# Altium schematic sheet 3.ETH.SchDoc: MC-IMX6UL-CORE
size A4; DrawnBy: DrawnBy; DocumentNumber: MC-IMX6UL-CORE; Revision: V1.1; SheetNumber: 3 of 9
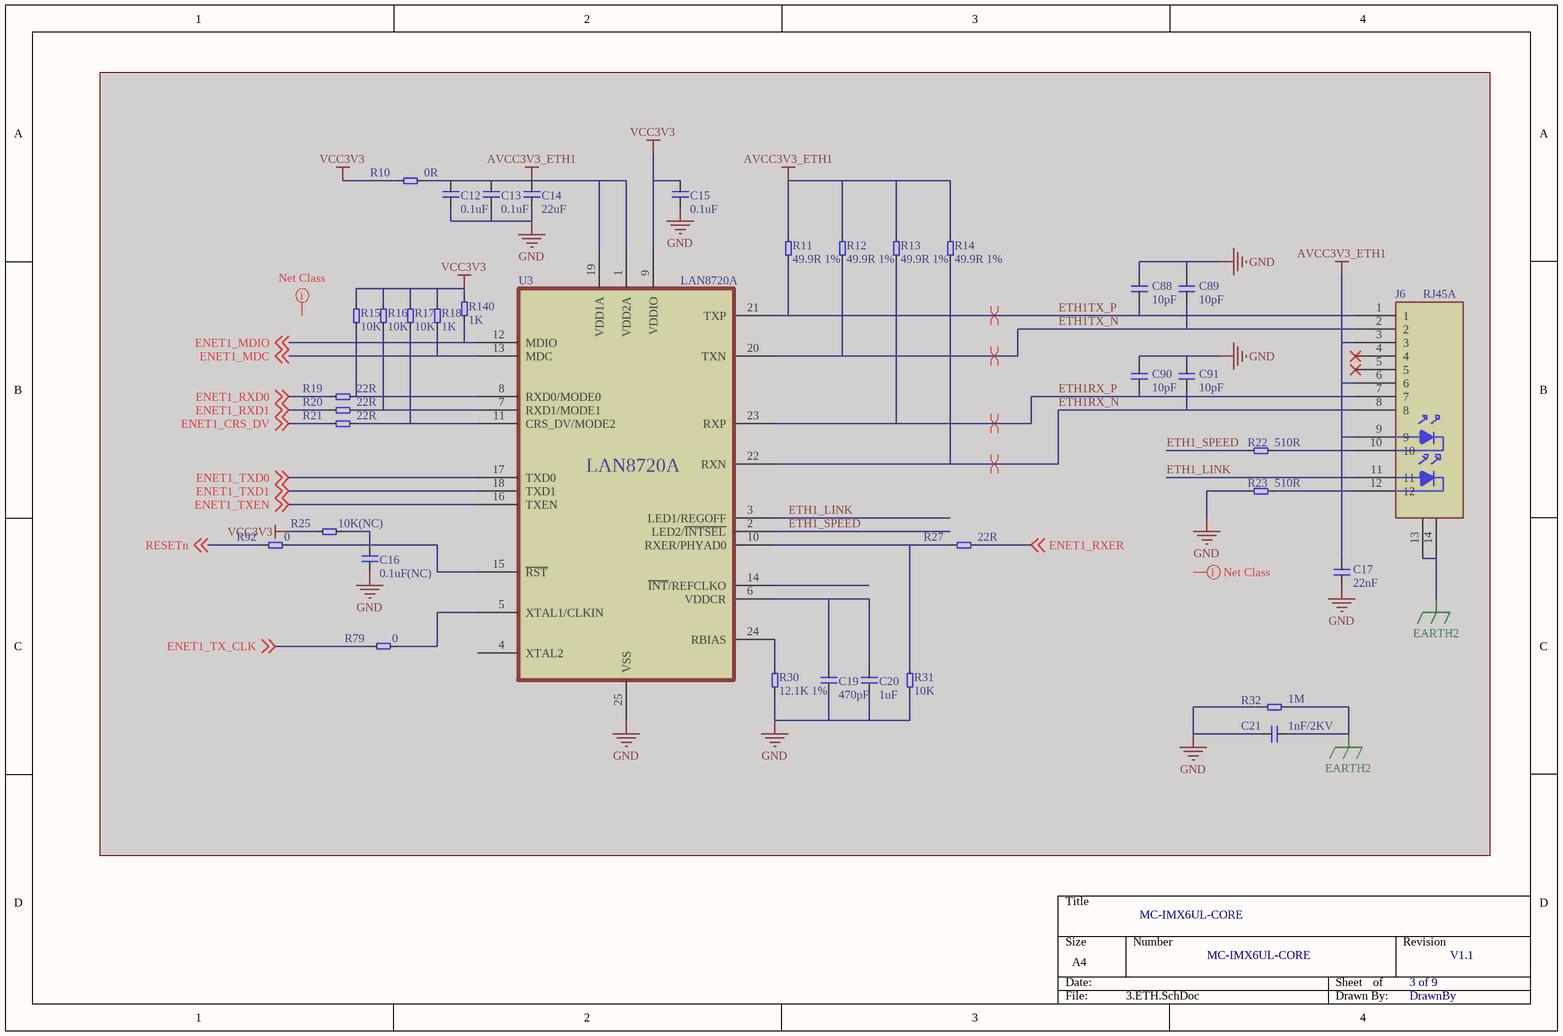
[diagram p0: 3.ETH.SchDoc]

## Parts
C12  0.1uF  [0603C]  (masked out: inside a compile mask, not in the netlist)
C13  0.1uF  [0603C]  (masked out: inside a compile mask, not in the netlist)
C14  22uF  [0805C]  (masked out: inside a compile mask, not in the netlist)
C15  0.1uF  [0603C]  (masked out: inside a compile mask, not in the netlist)
C16  0.1uF(NC)  [0603C]  (masked out: inside a compile mask, not in the netlist)
C17  22nF  [0603C]  (masked out: inside a compile mask, not in the netlist)
C19  470pF  [0603C]  (masked out: inside a compile mask, not in the netlist)
C20  1uF  [0603C]  (masked out: inside a compile mask, not in the netlist)
C21  1nF/2KV  [DC-200]  (masked out: inside a compile mask, not in the netlist)
C88  10pF  [0603C]  (masked out: inside a compile mask, not in the netlist)
C89  10pF  [0603C]  (masked out: inside a compile mask, not in the netlist)
C90  10pF  [0603C]  (masked out: inside a compile mask, not in the netlist)
C91  10pF  [0603C]  (masked out: inside a compile mask, not in the netlist)
J6  RJ45A  [RJ45B-13F-60LDNL]  (masked out: inside a compile mask, not in the netlist)
R10  0R  [0603R]  (masked out: inside a compile mask, not in the netlist)
R11  49.9R 1%  [0603R]  (masked out: inside a compile mask, not in the netlist)
R12  49.9R 1%  [0603R]  (masked out: inside a compile mask, not in the netlist)
R13  49.9R 1%  [0603R]  (masked out: inside a compile mask, not in the netlist)
R14  49.9R 1%  [0603R]  (masked out: inside a compile mask, not in the netlist)
R15  10K  [0603R]  (masked out: inside a compile mask, not in the netlist)
R16  10K  [0603R]  (masked out: inside a compile mask, not in the netlist)
R17  10K  [0603R]  (masked out: inside a compile mask, not in the netlist)
R18  1K  [0603R]  (masked out: inside a compile mask, not in the netlist)
R19  22R  [0603R]  (masked out: inside a compile mask, not in the netlist)
R20  22R  [0603R]  (masked out: inside a compile mask, not in the netlist)
R21  22R  [0603R]  (masked out: inside a compile mask, not in the netlist)
R22  510R  [0603R]  (masked out: inside a compile mask, not in the netlist)
R23  510R  [0603R]  (masked out: inside a compile mask, not in the netlist)
R25  10K(NC)  [0603R]  (masked out: inside a compile mask, not in the netlist)
R27  22R  [0603R]  (masked out: inside a compile mask, not in the netlist)
R30  12.1K 1%  [0603R]  (masked out: inside a compile mask, not in the netlist)
R31  10K  [0603R]  (masked out: inside a compile mask, not in the netlist)
R32  1M  [1206R]  (masked out: inside a compile mask, not in the netlist)
R79  0  [0603R]  (masked out: inside a compile mask, not in the netlist)
R92  0  [0603R]  (masked out: inside a compile mask, not in the netlist)
R140  1K  [0603R]  (masked out: inside a compile mask, not in the netlist)
U3  LAN8720A  [QFN24]  (masked out: inside a compile mask, not in the netlist)

## Layout directives
differential pair: (no net found under the mark)
net class ETH0: (no net found under the mark)

## Library data of the parts
C12-C17 C19-C21 C88-C91 = 电容
R10-R23 R25 R27 R30-R32 R79 R92 R140 = 电阻